# Altium schematic sheet Eight_5x7.SCHDOC
size A4 portrait; Organization: Altium Limited; Address1: L3, 12a Rodborough Rd; Address2: Frenchs Forest; Address3: NSW; Address4: Australia 2086; DocumentNumber: 2; SheetNumber: 2; SheetTotal: 7
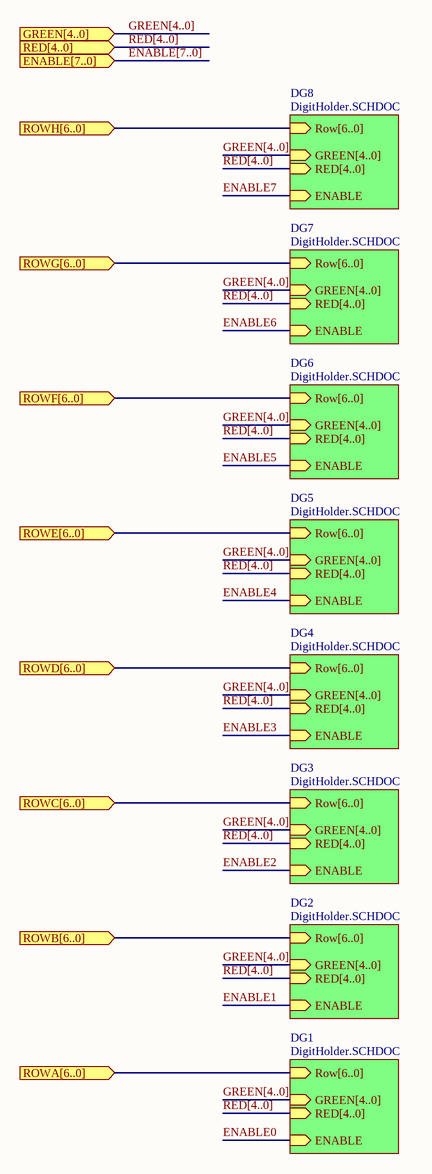
[diagram p0: Eight_5x7.SCHDOC]

## Sub-sheets
DG1 = DigitHolder.SCHDOC: Row[6..0] (in), ENABLE (in), GREEN[4..0] (in), RED[4..0] (in)
DG2 = DigitHolder.SCHDOC: Row[6..0] (in), ENABLE (in), GREEN[4..0] (in), RED[4..0] (in)
DG3 = DigitHolder.SCHDOC: Row[6..0] (in), ENABLE (in), GREEN[4..0] (in), RED[4..0] (in)
DG4 = DigitHolder.SCHDOC: Row[6..0] (in), ENABLE (in), GREEN[4..0] (in), RED[4..0] (in)
DG5 = DigitHolder.SCHDOC: Row[6..0] (in), ENABLE (in), GREEN[4..0] (in), RED[4..0] (in)
DG6 = DigitHolder.SCHDOC: Row[6..0] (in), ENABLE (in), GREEN[4..0] (in), RED[4..0] (in)
DG7 = DigitHolder.SCHDOC: Row[6..0] (in), ENABLE (in), GREEN[4..0] (in), RED[4..0] (in)
DG8 = DigitHolder.SCHDOC: Row[6..0] (in), ENABLE (in), GREEN[4..0] (in), RED[4..0] (in)

## Ports
ENABLE[7..0] (in), GREEN[4..0] (in), RED[4..0] (in), ROWA[6..0] (in), ROWB[6..0] (in), ROWC[6..0] (in), ROWD[6..0] (in), ROWE[6..0] (in), ROWF[6..0] (in), ROWG[6..0] (in), ROWH[6..0] (in)

## Nets
ENABLE0: sheet DG1/ENABLE
ENABLE1: sheet DG2/ENABLE
ENABLE2: sheet DG3/ENABLE
ENABLE3: sheet DG4/ENABLE
ENABLE4: sheet DG5/ENABLE
ENABLE5: sheet DG6/ENABLE
ENABLE6: sheet DG7/ENABLE
ENABLE7: sheet DG8/ENABLE

## Buses and harness runs
bus ENABLE[7..0] = port ENABLE[7..0]
bus GREEN[4..0] = port GREEN[4..0]
bus GREEN[4..0] = sheet DG1/GREEN[4..0]
bus GREEN[4..0] = sheet DG2/GREEN[4..0]
bus GREEN[4..0] = sheet DG3/GREEN[4..0]
bus GREEN[4..0] = sheet DG4/GREEN[4..0]
bus GREEN[4..0] = sheet DG5/GREEN[4..0]
bus GREEN[4..0] = sheet DG6/GREEN[4..0]
bus GREEN[4..0] = sheet DG7/GREEN[4..0]
bus GREEN[4..0] = sheet DG8/GREEN[4..0]
bus port ROWA[6..0] = sheet DG1/Row[6..0]
bus port ROWB[6..0] = sheet DG2/Row[6..0]
bus port ROWC[6..0] = sheet DG3/Row[6..0]
bus port ROWD[6..0] = sheet DG4/Row[6..0]
bus port ROWE[6..0] = sheet DG5/Row[6..0]
bus port ROWF[6..0] = sheet DG6/Row[6..0]
bus port ROWG[6..0] = sheet DG7/Row[6..0]
bus port ROWH[6..0] = sheet DG8/Row[6..0]
bus RED[4..0] = port RED[4..0]
bus RED[4..0] = sheet DG1/RED[4..0]
bus RED[4..0] = sheet DG2/RED[4..0]
bus RED[4..0] = sheet DG3/RED[4..0]
bus RED[4..0] = sheet DG4/RED[4..0]
bus RED[4..0] = sheet DG5/RED[4..0]
bus RED[4..0] = sheet DG6/RED[4..0]
bus RED[4..0] = sheet DG7/RED[4..0]
bus RED[4..0] = sheet DG8/RED[4..0]

## Notes on the sheet
- Title
- Size:
- Date:
- A4
- Number:
- Time:
- Revision:
- Sheet
- of
- File: